# Altium schematic sheet YL203纯密码板2084.SchDoc
size A2; PageSetup: Record=PageOptions|CenterHorizontal=True|CenterVertical=True|PrintScale=0.52|XCorrection=1.00|YCorrection=1.00|PrintKind=0|BorderSize=5000000|LeftOffset=0|BottomOffset=0|Orientation=2|PaperLength=1000|PaperWidth=1000|Scale=100|PaperSource=7|PrintQuality=-4|MediaType=1|DitherType=10|PaperKind=A4|PrintScaleMode=1
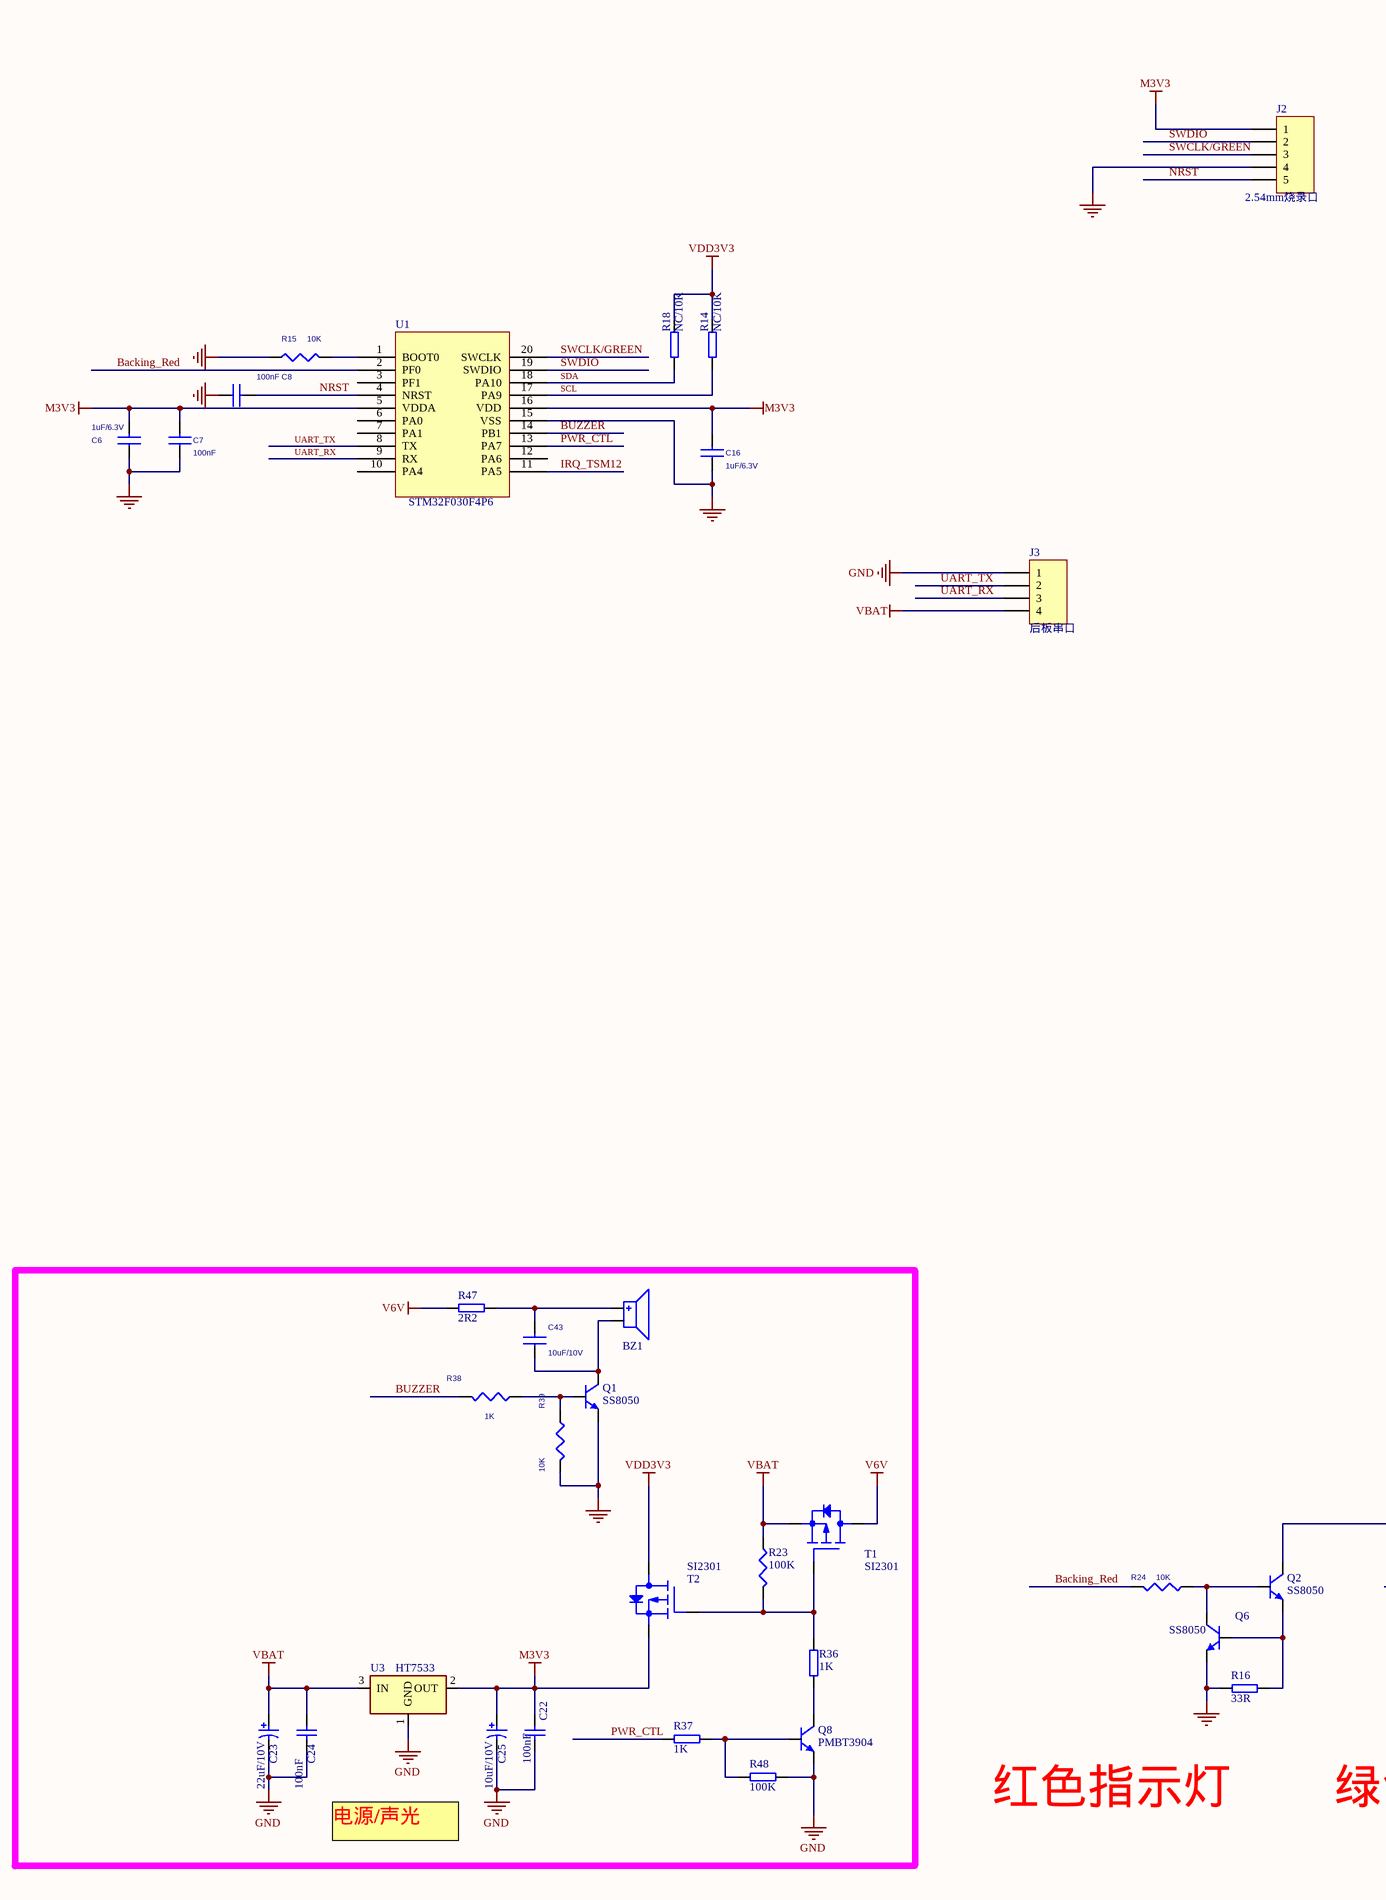
[diagram p0: YL203纯密码板2084.SchDoc, left]
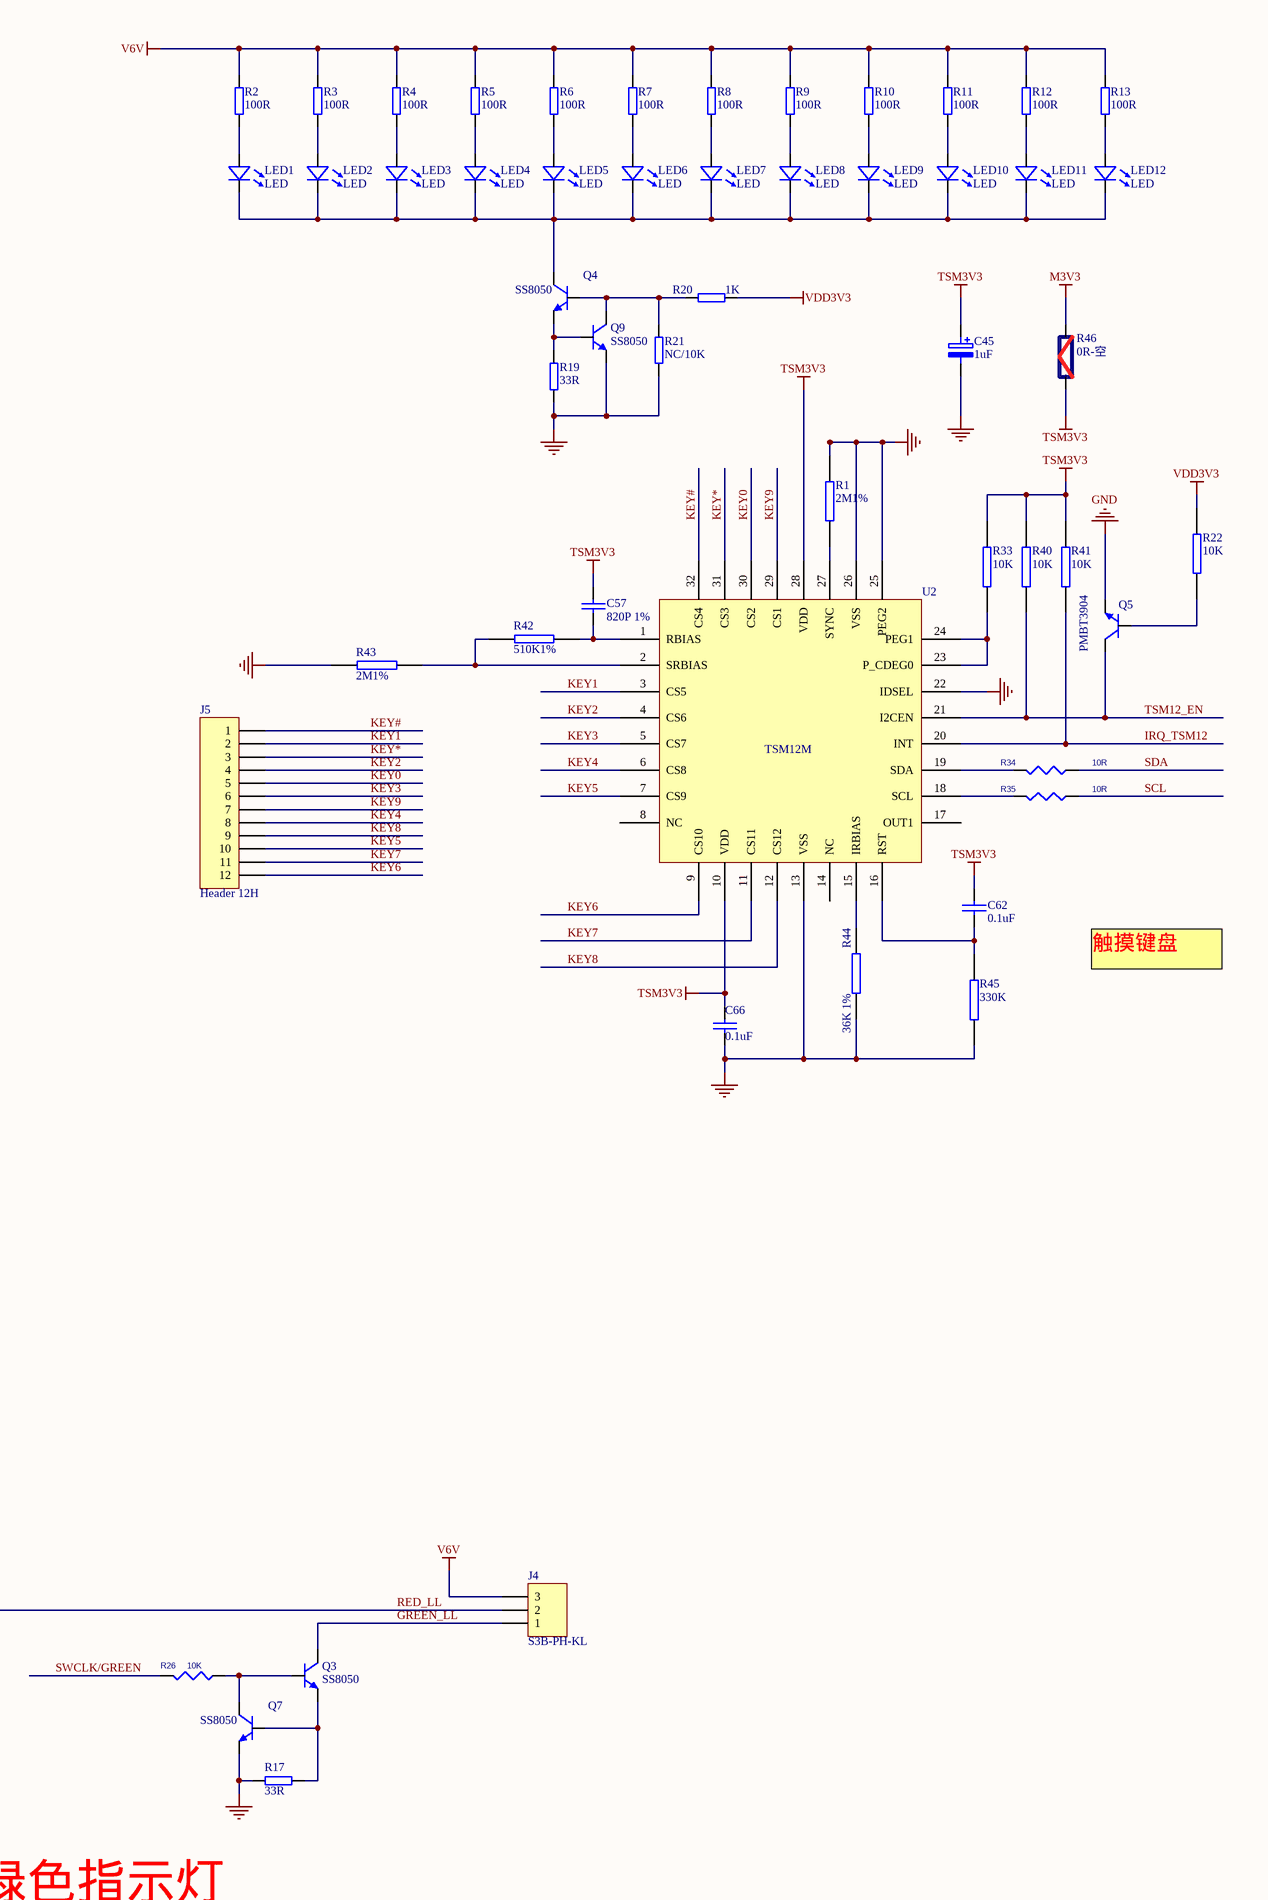
[diagram p1: YL203纯密码板2084.SchDoc, right]

## Parts
BZ1  BUZZER  [BUZZER_D93_L40]  (value not drawn)
C6  1uF/6.3V  [LC-0603_C]
C7  100nF  [LC-0603_C]
C8  100nF  [LC-0603_C]
C16  1uF/6.3V  [LC-0603_C]
C22  100nF  [LC-0603_C]
C23  22uF/10V  [LC-0805_C]
C24  100nF  [LC-0603_C]
C25  10uF/10V  [LC-0805_C]
C43  10uF/10V  [LC-0603_C]
C45  1uF  [LC-0603_C]
C57  820P 1%  [LC-0402_C]
C62  0.1uF  [LC-0603_C]
C66  0.1uF  [LC-0402_C]
J2  2.54mm烧录口  [5P-2.54mm]
J3  后板串口  [4P-2.0XX]
J4  S3B-PH-KL  [3P-1.25mm-SMT]
J5  Header 12H  [6P*2*1.27MM_1]
LED1  LED  [0603LED]
LED2  LED  [0603LED]
LED3  LED  [0603LED]
LED4  LED  [0603LED]
LED5  LED  [0603LED]
LED6  LED  [0603LED]
LED7  LED  [0603LED]
LED8  LED  [0603LED]
LED9  LED  [0603LED]
LED10  LED  [0603LED]
LED11  LED  [0603LED]
LED12  LED  [0603LED]
Q1  SS8050  [SOT-23-3L]
Q2  SS8050  [SOT-23-3L]
Q3  SS8050  [SOT-23-3L]
Q4  SS8050  [SOT-23-3L]
Q5  PMBT3904  [SOT-23-3L]
Q6  SS8050  [SOT-23-3L]
Q7  SS8050  [SOT-23-3L]
Q8  PMBT3904  [SOT-23-3L]
Q9  SS8050  [SOT-23-3L]
R1  2M1%  [LC-0402_R]
R2  100R  [LC-0603_R]
R3  100R  [LC-0603_R]
R4  100R  [LC-0603_R]
R5  100R  [LC-0603_R]
R6  100R  [LC-0603_R]
R7  100R  [LC-0603_R]
R8  100R  [LC-0603_R]
R9  100R  [LC-0603_R]
R10  100R  [LC-0603_R]
R11  100R  [LC-0603_R]
R12  100R  [LC-0603_R]
R13  100R  [LC-0603_R]
R14  NC/10K  [LC-0603_R]
R15  10K  [LC-0603_R]
R16  33R  [LC-0603_R]
R17  33R  [LC-0603_R]
R18  NC/10K  [LC-0603_R]
R19  33R  [LC-0603_R]
R20  1K  [LC-0603_R]
R21  NC/10K  [LC-0603_R]
R22  10K  [LC-0603_R]
R23  100K  [LC-0603_R]
R24  10K  [LC-0603_R]
R26  10K  [LC-0603_R]
R33  10K  [LC-0402_R]
R34  10R  [LC-0402_R]
R35  10R  [LC-0402_R]
R36  1K  [LC-0603_R]
R37  1K  [LC-0603_R]
R38  1K  [LC-0603_R]
R39  10K  [LC-0603_R]
R40  10K  [LC-0402_R]
R41  10K  [LC-0402_R]
R42  510K1%  [LC-0402_R]
R43  2M1%  [LC-0402_R]
R44  36K 1%  [LC-0402_R]
R45  330K  [LC-0402_R]
R46  0R-空  [LC-0603_R]
R47  2R2  [LC-0603_R]
R48  100K  [LC-0603_R]
T1  SI2301  [SOT-23 - GDS]
T2  SI2301  [SOT-23 - GDS]
U1  STM32F030F4P6  [TSSOP-20-0.66]
U2  TSM12M  [ADS_TMS12]
U3  HT7533  [SOT-23-3L]

## Nets
GND: C6.1 C7.1 C8.1 C16.1 C22.2 C23.2 C24.2 C25.2 C45.2 C66.1 J2.4 J3.1 Q1.2 Q5.2 Q6.2 Q7.2 Q8.2 Q9.2 R1.2 R15.1 R16.2 R17.2 R19.1 R21.1 R39.2 R43.1 R44.1 R45.1 R48.1 U1.15(VSS) U2.13(VSS) U2.22(IDSEL) U2.25(PEG2) U2.26(VSS) U3.1(GND)
M3V3: C6.2 C7.2 C16.2 C22.1 C25.1 J2.1 R46.2 T2.S(SOURCE) U1.5(VDDA) U1.16(VDD) U3.2(OUT)
TSM3V3: C45.1 C57.2 C62.2 C66.2 R33.2 R40.2 R41.2 R46.1 U2.10(VDD) U2.28(VDD)
V6V: J4.3 R2.2 R3.2 R4.2 R5.2 R6.2 R7.2 R8.2 R9.2 R10.2 R11.2 R12.2 R13.2 R47.2 T1.D(DRAIN)
VBAT: C23.1 C24.1 J3.4 R23.1 T1.S(SOURCE) U3.3(IN)
VDD3V3: R14.2 R18.2 R20.2 R22.2 T2.D(DRAIN)
Backing_Red: R24.2 U1.2(PF0)
BUZZER: R38.2 U1.14(PB1)
GREEN_LL: J4.1 Q3.3
IRQ_TSM12: R41.1 U1.11(PA5) U2.20(INT)
KEY0: J5.5 U2.30(CS2)
KEY1: J5.2 U2.3(CS5)
KEY2: J5.4 U2.4(CS6)
KEY3: J5.6 U2.5(CS7)
KEY4: J5.8 U2.6(CS8)
KEY5: J5.10 U2.7(CS9)
KEY6: J5.12 U2.9(CS10)
KEY7: J5.11 U2.11(CS11)
KEY8: J5.9 U2.12(CS12)
KEY9: J5.7 U2.29(CS1)
KEY#: J5.1 U2.32(CS4)
KEY*: J5.3 U2.31(CS3)
NRST: C8.2 J2.5 U1.4(NRST)
PWR_CTL: R37.1 U1.13(PA7)
RED_LL: J4.2 Q2.3
SCL: R14.1 R35.1 U1.17(PA9)
SDA: R18.1 R34.1 U1.18(PA10)
SWCLK/GREEN: J2.3 R26.2 U1.20(SWCLK)
SWDIO: J2.2 U1.19(SWDIO)
TSM12_EN: Q5.3 R40.1 U2.21(I2CEN)
UART_RX: J3.3 U1.9(RX)
UART_TX: J3.2 U1.8(TX)
NetBZ1_1: BZ1.1 C43.2 R47.1
NetBZ1_2: BZ1.2 C43.1 Q1.3
NetC57_1: C57.1 R42.2 U2.1(RBIAS)
NetC62_1: C62.1 R45.2 U2.16(RST)
NetLED1_1: LED1.1(a) R2.1
NetLED1_2: LED1.2(k) LED2.2(k) LED3.2(k) LED4.2(k) LED5.2(k) LED6.2(k) LED7.2(k) LED8.2(k) LED9.2(k) LED10.2(k) LED11.2(k) LED12.2(k) Q4.3
NetLED2_1: LED2.1(a) R3.1
NetLED3_1: LED3.1(a) R4.1
NetLED4_1: LED4.1(a) R5.1
NetLED5_1: LED5.1(a) R6.1
NetLED6_1: LED6.1(a) R7.1
NetLED7_1: LED7.1(a) R8.1
NetLED8_1: LED8.1(a) R9.1
NetLED9_1: LED9.1(a) R10.1
NetLED10_1: LED10.1(a) R11.1
NetLED11_1: LED11.1(a) R12.1
NetLED12_1: LED12.1(a) R13.1
NetQ1_1: Q1.1 R38.1 R39.1
NetQ2_1: Q2.1 Q6.3 R24.1
NetQ2_2: Q2.2 Q6.1 R16.1
NetQ3_1: Q3.1 Q7.3 R26.1
NetQ3_2: Q3.2 Q7.1 R17.1
NetQ4_1: Q4.1 Q9.3 R20.1 R21.2
NetQ4_2: Q4.2 Q9.1 R19.2
NetQ5_1: Q5.1 R22.1
NetQ8_1: Q8.1 R37.2 R48.2
NetQ8_3: Q8.3 R36.2
NetR1_1: R1.1 U2.27(SYNC)
NetR15_2: R15.2 U1.1(BOOT0)
NetR23_2: R23.2 R36.1 T1.G(GATE) T2.G(GATE)
NetR33_1: R33.1 U2.23(P_CDEG0) U2.24(PEG1)
NetR34_2: R34.2 U2.19(SDA)
NetR35_2: R35.2 U2.18(SCL)
NetR42_1: R42.1 R43.2 U2.2(SRBIAS)
NetR44_2: R44.2 U2.15(IRBIAS)

Not connected (* = marked no-connect by the designer): U1 3(PF1) 6(PA0) 7(PA1) 10(PA4) 12(PA6); U2 8(NC) 14(NC) 17(OUT1)

## Notes on the sheet
- 触摸键盘
- 红色指示灯
- 绿色指示灯
- 电源/声光

## Library data of the parts
C6-C8 C16 = CAP NP
C22 C24 = CAP-NP: Capacitor, Ceramic; Capacitance: 18 pF; Dielectric: COG; Polarity: Non-Polarized; Rated Voltage: 50 mV; Tolerance: 5 %; Category: Capacitor; Mounting Technology: Surface Mount; Status: Unreleased; Technology: Ceramic
C23 C25 = CAP-P: Capacitor, tolerance ±20%
C43 = C_0_Dup1
C45 = C-C?: Electrolytic Capacitor
C57 C62 C66 = CAP: Capacitor
J2 = Header 5: Header, 5-Pin; LatestRevisionDate: 17-Jul-2002; LatestRevisionNote: Re-released for DXP Platform.; Publisher: Altium Limited
J3 = Header 4H: Header, 4-Pin, Right Angle; LatestRevisionDate: 17-Jul-2002; LatestRevisionNote: Re-released for DXP Platform.; Publisher: Altium Limited
J4 = Header 3: Header, 3-Pin; LatestRevisionDate: 17-Jul-2002; LatestRevisionNote: Re-released for DXP Platform.; Publisher: Altium Limited
J5 = Header 12H: Header, 12-Pin, Right Angle; LatestRevisionDate: 17-Jul-2002; LatestRevisionNote: Re-released for DXP Platform.; Publisher: Altium Limited
Q1-Q9 = NPN_BJT: Bipolar Junction Transistor
R1 R22 R33 R40-R45 = RES2
R2-R14 R16-R21 R23 R36 R37 R47 R48 = R
R15 R34 R35 R38 R39 = R_Dup1
R24 R26 = RES
R46 = POWER-R
T1 T2 = PWRMOSFET_EP_DGS_0
U1 = Component_1
U3 = XC6206P302M